# EAGLE design Rev B (Main Board) (EAGLE 9.6.2)
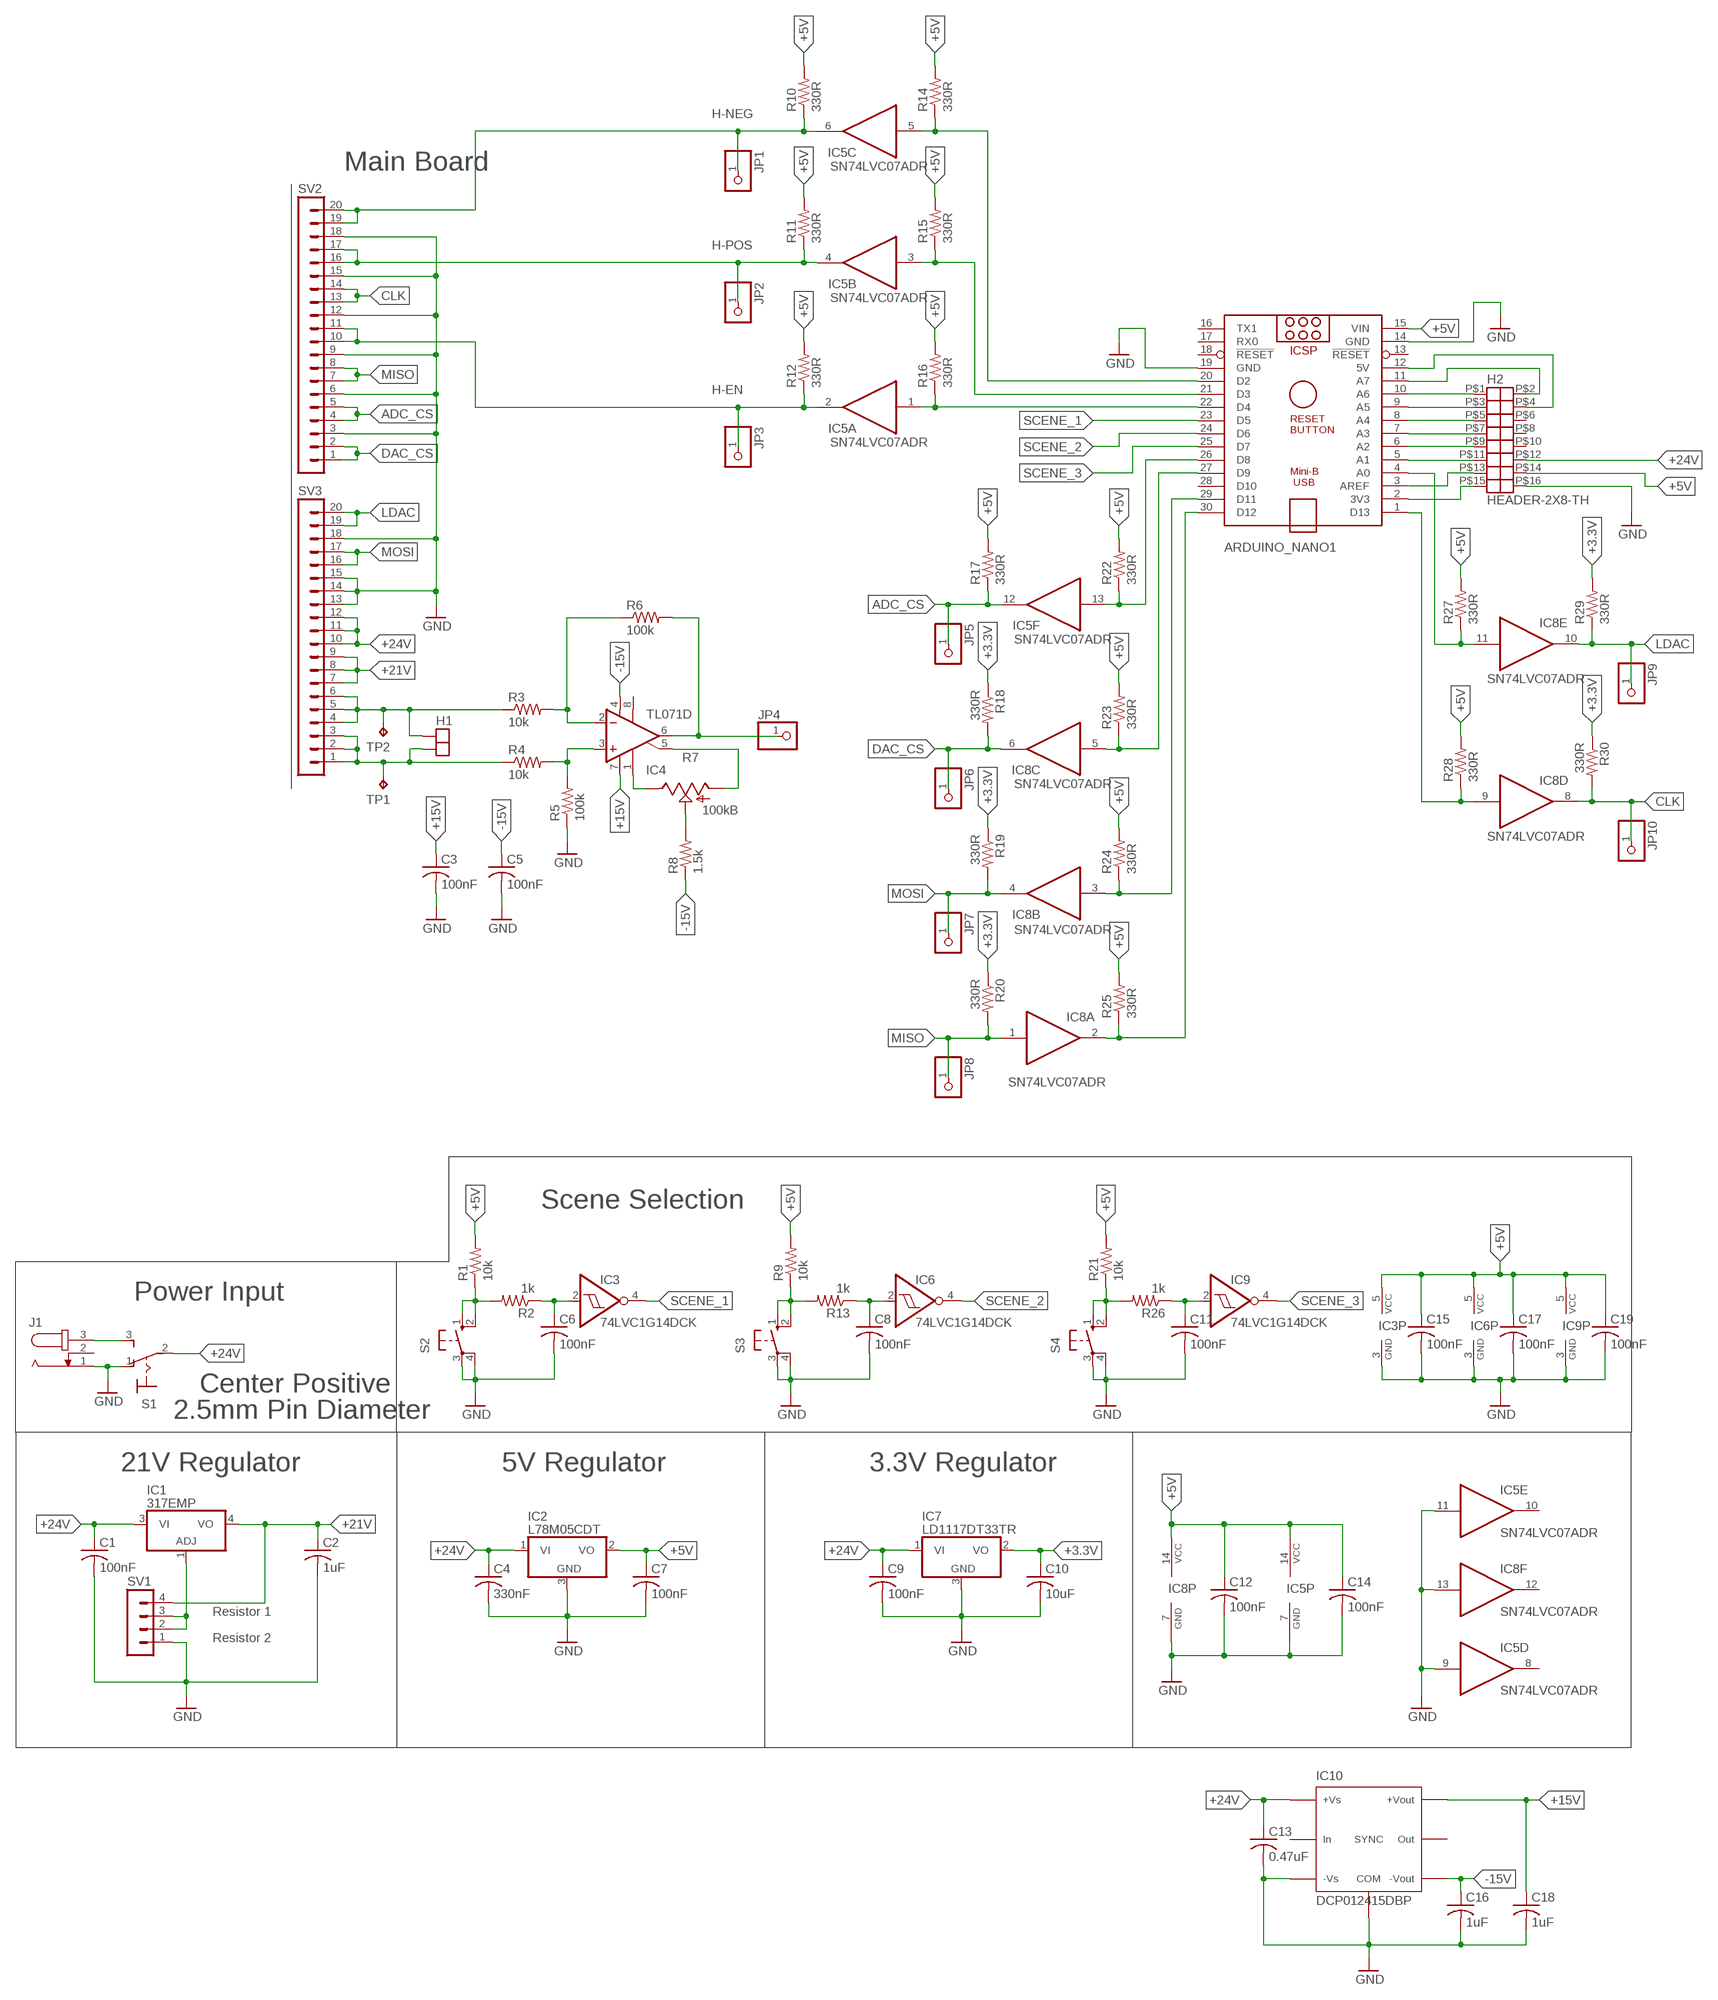
[diagram p0: schematic, sheet 1]

## Parts
ARDUINO_NANO1  ARDUINO_NANO  [ARDUINO_NANO]
C1  100nF  C-USC0805  [C0805]
C2  1uF  C-USC0805  [C0805]
C3  100nF  C-USC0805  [C0805]
C4  330nF  C-USC0805  [C0805]
C5  100nF  C-USC0805  [C0805]
C6  100nF  C-USC0805  [C0805]
C7  100nF  C-USC0805  [C0805]
C8  100nF  C-USC0805  [C0805]
C9  100nF  C-USC0805  [C0805]
C10  10uF  C-USC0805  [C0805]
C11  100nF  C-USC0805  [C0805]
C12  100nF  C-USC0805  [C0805]
C13  0.47uF  C-USC0805  [C0805]
C14  100nF  C-USC0805  [C0805]
C15  100nF  C-USC0805  [C0805]
C16  1uF  C-USC0805  [C0805]
C17  100nF  C-USC0805  [C0805]
C18  1uF  C-USC0805  [C0805]
C19  100nF  C-USC0805  [C0805]
H1  HEADER-1X2  [HEADER-1X2-TH]
H2  HEADER-2X8-TH  [HEADER-2X8-TH]
IC1  317EMP  [SOT223]
IC2  L78M05CDT  7818DT  [TO252]
IC3  74LVC1G14DCK  [SC70-5]
IC4  TL071D  [SO08]
IC5  SN74LVC07ADR  74LS07D  [SO14]
IC6  74LVC1G14DCK  [SC70-5]
IC7  LD1117DT33TR  7818DT  [TO252]
IC8  SN74LVC07ADR  74LS07D  [SO14]
IC9  74LVC1G14DCK  [SC70-5]
IC10  DCP012415DBP  [7-PDIP]
J1  JACK-PLUG1  [SPC4078]
JP1  PINHD-1X1  [1X01]
JP2  PINHD-1X1  [1X01]
JP3  PINHD-1X1  [1X01]
JP4  PINHD-1X1  [1X01]
JP5  PINHD-1X1  [1X01]
JP6  PINHD-1X1  [1X01]
JP7  PINHD-1X1  [1X01]
JP8  PINHD-1X1  [1X01]
JP9  PINHD-1X1  [1X01]
JP10  PINHD-1X1  [1X01]
R1  10k  R-US_R0805  [R0805]
R2  1k  R-US_R0805  [R0805]
R3  10k  R-US_R0805  [R0805]
R4  10k  R-US_R0805  [R0805]
R5  100k  R-US_R0805  [R0805]
R6  100k  R-US_R0805  [R0805]
R7  100kB  TRIM_US-RJ9W  [RJ9W]
R8  1.5k  R-US_R0805  [R0805]
R9  10k  R-US_R0805  [R0805]
R10  330R  R-US_R0805  [R0805]
R11  330R  R-US_R0805  [R0805]
R12  330R  R-US_R0805  [R0805]
R13  1k  R-US_R0805  [R0805]
R14  330R  R-US_R0805  [R0805]
R15  330R  R-US_R0805  [R0805]
R16  330R  R-US_R0805  [R0805]
R17  330R  R-US_R0805  [R0805]
R18  330R  R-US_R0805  [R0805]
R19  330R  R-US_R0805  [R0805]
R20  330R  R-US_R0805  [R0805]
R21  10k  R-US_R0805  [R0805]
R22  330R  R-US_R0805  [R0805]
R23  330R  R-US_R0805  [R0805]
R24  330R  R-US_R0805  [R0805]
R25  330R  R-US_R0805  [R0805]
R26  1k  R-US_R0805  [R0805]
R27  330R  R-US_R0805  [R0805]
R28  330R  R-US_R0805  [R0805]
R29  330R  R-US_R0805  [R0805]
R30  330R  R-US_R0805  [R0805]
S1  320-916  [320-916]
S2  10-XX  [B3F-10XX]
S3  10-XX  [B3F-10XX]
S4  10-XX  [B3F-10XX]
SV1  MA04-1  [MA04-1]
SV2  MA20-1W  [MA20-1W]
SV3  MA20-1W  [MA20-1W]
TP1  TPB2,54  [B2,54]
TP2  TPB2,54  [B2,54]

## Nets
+3.3V: C10.1 IC7.2(VO) R18.1 R19.1 R20.1 R29.2 R30.1
+5V: ARDUINO_NANO1.15(VIN) C7.1 C12.1 C14.1 C15.1 C17.1 C19.1 H2.P$14 IC2.2(VO) IC3.5(VCC) IC5.14(P:VCC) IC6.5(VCC) IC8.14(P:VCC) IC9.5(VCC) R1.2 R9.2 R10.2 R11.2 R12.2 R14.2 R15.2 R16.2 R17.2 R21.2 R22.2 R23.2 R24.2 R25.2 R27.2 R28.2
+15V: C3.1 C18.1 IC4.7(V+) IC10.P$4
+21V: C2.1 IC1.4(VO) SV1.4 SV3.7 SV3.8 SV3.9
+24V: C1.1 C4.1 C9.1 C13.1 H2.P$12 IC1.3(VI) IC2.1(VI) IC7.1(VI) IC10.P$1 S1.2(P) SV3.10 SV3.11 SV3.12
-15V: C5.1 C16.1 IC4.4(V-) IC10.P$5 R8.1
ADC_CS: IC5.12(F:O) JP5.1 R17.1 SV2.4 SV2.5
CLK: IC8.8(D:O) JP10.1 R30.2 SV2.13 SV2.14
DAC_CS: IC8.6(C:O) JP6.1 R18.2 SV2.1 SV2.2
GND: ARDUINO_NANO1.14(GND) ARDUINO_NANO1.19(GND) C1.2 C2.2 C3.2 C4.2 C5.2 C6.2 C7.2 C8.2 C9.2 C10.2 C11.2 C12.2 C13.2 C14.2 C15.2 C16.2 C17.2 C18.2 C19.2 H2.P$16 IC2.3(GND) IC3.3(GND) IC5.7(P:GND) IC5.9(D:I) IC5.11(E:I) IC6.3(GND) IC7.3(GND) IC8.7(P:GND) IC8.13(F:I) IC9.3(GND) IC10.P$2 IC10.P$3 J1.1 R5.1 S1.1(O) S2.3(P) S2.4(P1) S3.3(P) S3.4(P1) S4.3(P) S4.4(P1) SV1.1 SV2.3 SV2.6 SV2.9 SV2.12 SV2.15 SV2.18 SV3.13 SV3.14 SV3.15 SV3.18
LDAC: IC8.10(E:O) JP9.1 R29.1 SV3.19 SV3.20
MISO: IC8.1(A:I) JP8.1 R20.2 SV2.7 SV2.8
MOSI: IC8.4(B:O) JP7.1 R19.2 SV3.16 SV3.17
N$1: IC5.2(A:O) JP3.1 R12.1 SV2.10 SV2.11
N$2: IC4.2(-IN) R3.2 R6.1
N$3: J1.3 S1.3(S)
N$4: ARDUINO_NANO1.2(3V3) H2.P$15
N$5: ARDUINO_NANO1.21(D3) IC5.3(B:I) R15.1
N$6: ARDUINO_NANO1.3(AREF) H2.P$13
N$7: ARDUINO_NANO1.5(A1) H2.P$11
N$8: ARDUINO_NANO1.6(A2) H2.P$9
N$9: ARDUINO_NANO1.22(D4) IC5.1(A:I) R16.1
N$10: ARDUINO_NANO1.7(A3) H2.P$7
N$11: ARDUINO_NANO1.8(A4) H2.P$5
N$12: ARDUINO_NANO1.9(A5) H2.P$3
N$13: ARDUINO_NANO1.10(A6) H2.P$1
N$14: ARDUINO_NANO1.11(A7) H2.P$2
N$15: ARDUINO_NANO1.12(5V) H2.P$4
N$19: ARDUINO_NANO1.27(D9) IC8.5(C:I) R23.1
N$20: ARDUINO_NANO1.1(D13) IC8.9(D:I) R28.1
N$21: ARDUINO_NANO1.29(D11) IC8.3(B:I) R24.1
N$22: H1.P$1 R3.1 SV3.4 SV3.5 SV3.6 TP2.TP
N$23: H1.P$2 R4.1 SV3.1 SV3.2 SV3.3 TP1.TP
N$24: ARDUINO_NANO1.4(A0) IC8.11(E:I) R27.1
N$25: ARDUINO_NANO1.30(D12) IC8.2(A:O) R25.1
N$26: IC5.4(B:O) JP2.1 R11.1 SV2.16 SV2.17
N$27: R1.1 R2.2 S2.1(S) S2.2(S1)
N$28: C6.1 IC3.2(I) R2.1
N$29: R9.1 R13.2 S3.1(S) S3.2(S1)
N$30: C8.1 IC6.2(I) R13.1
N$31: R21.1 R26.2 S4.1(S) S4.2(S1)
N$32: C11.1 IC9.2(I) R26.1
N$33: IC1.1(ADJ) SV1.2 SV1.3
N$34: ARDUINO_NANO1.20(D2) IC5.5(C:I) R14.1
N$35: ARDUINO_NANO1.26(D8) IC5.13(F:I) R22.1
N$36: IC5.6(C:O) JP1.1 R10.1 SV2.19 SV2.20
N$37: IC4.3(+IN) R4.2 R5.2
N$38: IC4.6(OUT) JP4.1 R6.2
N$39: IC4.1(ON1) R7.E
N$40: IC4.5(ON2) R7.A
N$41: R7.S R8.2
SCENE_1: ARDUINO_NANO1.23(D5) IC3.4(O)
SCENE_2: ARDUINO_NANO1.24(D6) IC6.4(O)
SCENE_3: ARDUINO_NANO1.25(D7) IC9.4(O)
Unconnected: ARDUINO_NANO1.13(!RESET) ARDUINO_NANO1.16(TX1) ARDUINO_NANO1.17(RX0) ARDUINO_NANO1.18(!RESET) ARDUINO_NANO1.28(D10) H2.P$6 H2.P$8 H2.P$10 IC4.8(OPT) IC5.8(D:O) IC5.10(E:O) IC8.12(F:O) IC10.P$6 IC10.P$7 J1.2

## Notes on the sheet
- H-NEG
- Main Board
- H-POS
- H-EN
- Scene Selection
- Power Input
- Center Positive
- 2.5mm Pin Diameter
- 21V Regulator | 5V Regulator | 3.3V Regulator
- Resistor 1
- Resistor 2

## Library data of the parts
ARDUINO_NANO1 = ArduinoNanoV30:ARDUINO_NANO: Arduino Nano V3.0 Overview: The Arduino Nano is a small, complete, and breadboard-friendly board based on the ATmega328 (Arduino Nano 3.x) or ATmega168 (Arduino Nano 2.x). It has more or less the same functionality of the Arduino Duemilanove, but in a different package. It lacks only a DC power jack, and works with a Mini-B USB cable instead of a standard one. The Nano was designed and is being produced by Gravitech. Specifications: Microcontroller Atmel ATmega168 or ATmega328 Operating Voltage (logic level) 5 V Input Voltage (recommended) 7-12 V Input Voltage (limits) 6-20 V Digital I/O Pins 14 (of which 6 provide PWM output) Analog Input Pins 8 DC Current per I/O Pin 40 mA Flash Memory 16 KB (ATmega168) or 32 KB (ATmega328) of which 2 KB used by bootloader SRAM 1 KB (ATmega168) or 2 KB (ATmega328) EEPROM 512 bytes (ATmega168) or 1 KB (ATmega328) Clock Speed 16 MHz Dimensions 0.73" x 1.70" Length 45 mm Width 18 mm Weigth 5 g Power: The Arduino Nano can be powered via the Mini-B USB connection, 6-20V unregulated external power supply (pin 30), or 5V regulated external power supply (pin 27). The power source is automatically selected to the highest voltage source. Memory: The ATmega168 has 16 KB of flash memory for storing code (of which 2 KB is used for the bootloader); the ATmega328 has 32 KB, (also with 2 KB used for the bootloader). The ATmega168 has 1 KB of SRAM and 512 bytes of EEPROM (which can be read and written with the EEPROM library); the ATmega328 has 2 KB of SRAM and 1 KB of EEPROM. Input and Output: Each of the 14 digital pins on the Nano can be used as an input or output, using pinMode(), digitalWrite(), and digitalRead() functions. They operate at 5 volts. Each pin can provide or receive a maximum of 40 mA and has an internal pull-up resistor (disconnected by default) of 20-50 kOhms. In addition, some pins have specialized functions. Visit Arduino - ArduinoBoardNano <https://www.arduino.cc/en/Main/ArduinoBoardNano>
C1-C19 = MMIModular Parts:C-US: CAPACITOR, American symbol; SPICEPREFIX: C
H1 = 4ms-main-parts:HEADER-1X2
H2 = 4ms-main-parts:HEADER-2X8: SMT HEADER 2x8 Unshrouded: Cixi Langling LL1010-5C (HI TEMP 2*8PIN) Shrouded: Cixi Langling LL1007-3 (2*8PIN)
IC1 = linear:*317: Positive VOLTAGE REGULATOR
IC2 IC7 = linear:78*: Positive VOLTAGE REGULATOR Source: http://cache.national.com/ds/LM/LM78L05.pdf http://www.fairchildsemi.com/ds/LM/LM7805.pdf
IC3 IC6 IC9 = 74xx-little-de:74*1G14: Single Schmitt-Trigger Inverter Gate
IC4 = linear:TL071: OP AMP
IC5 IC8 = 74xx-us:74*07: Hex BUFFER, open collector high-voltage output
IC10 = MMIModular Parts:DCP012415DBP
J1 = con-jack:JACK-PLUG: DC POWER JACK Power Jack, DC, Right Angle, Through Hole, Rated 5A at 16VDC, PC Terminals Distributor: Farnell (www.Farnell.de) Drawing: 84N1161.pdf / 84N1162.pdf Manufacturer: SPC Technology (www.spctechnology.com) Type: SPC4077 / SPC 4078; OC_FARNELL: unknown; OC_NEWARK: unknown
JP1-JP10 = pinhead:PINHD-1X1: PIN HEADER
R1-R6 R8-R30 = MMIModular Parts:R-US_: RESISTOR, American symbol; SPICEPREFIX: R
R7 = pot:TRIM_US-: POTENTIOMETER
S1 = switch:320-916: TOGGLE SWITCH distributor RS Components
S2-S4 = switch-omron:10-XX: OMRON SWITCH; MPN: B3F-1000; OC_FARNELL: 176432; OC_NEWARK: 36M3542
SV1 = con-lstb:MA04-1: PIN HEADER; OC_FARNELL: unknown; OC_NEWARK: unknown
SV2 SV3 = con-lstb:MA20-1W: PIN HEADER; OC_FARNELL: unknown; OC_NEWARK: unknown
TP1 TP2 = testpad:TP: Test pad

## Board
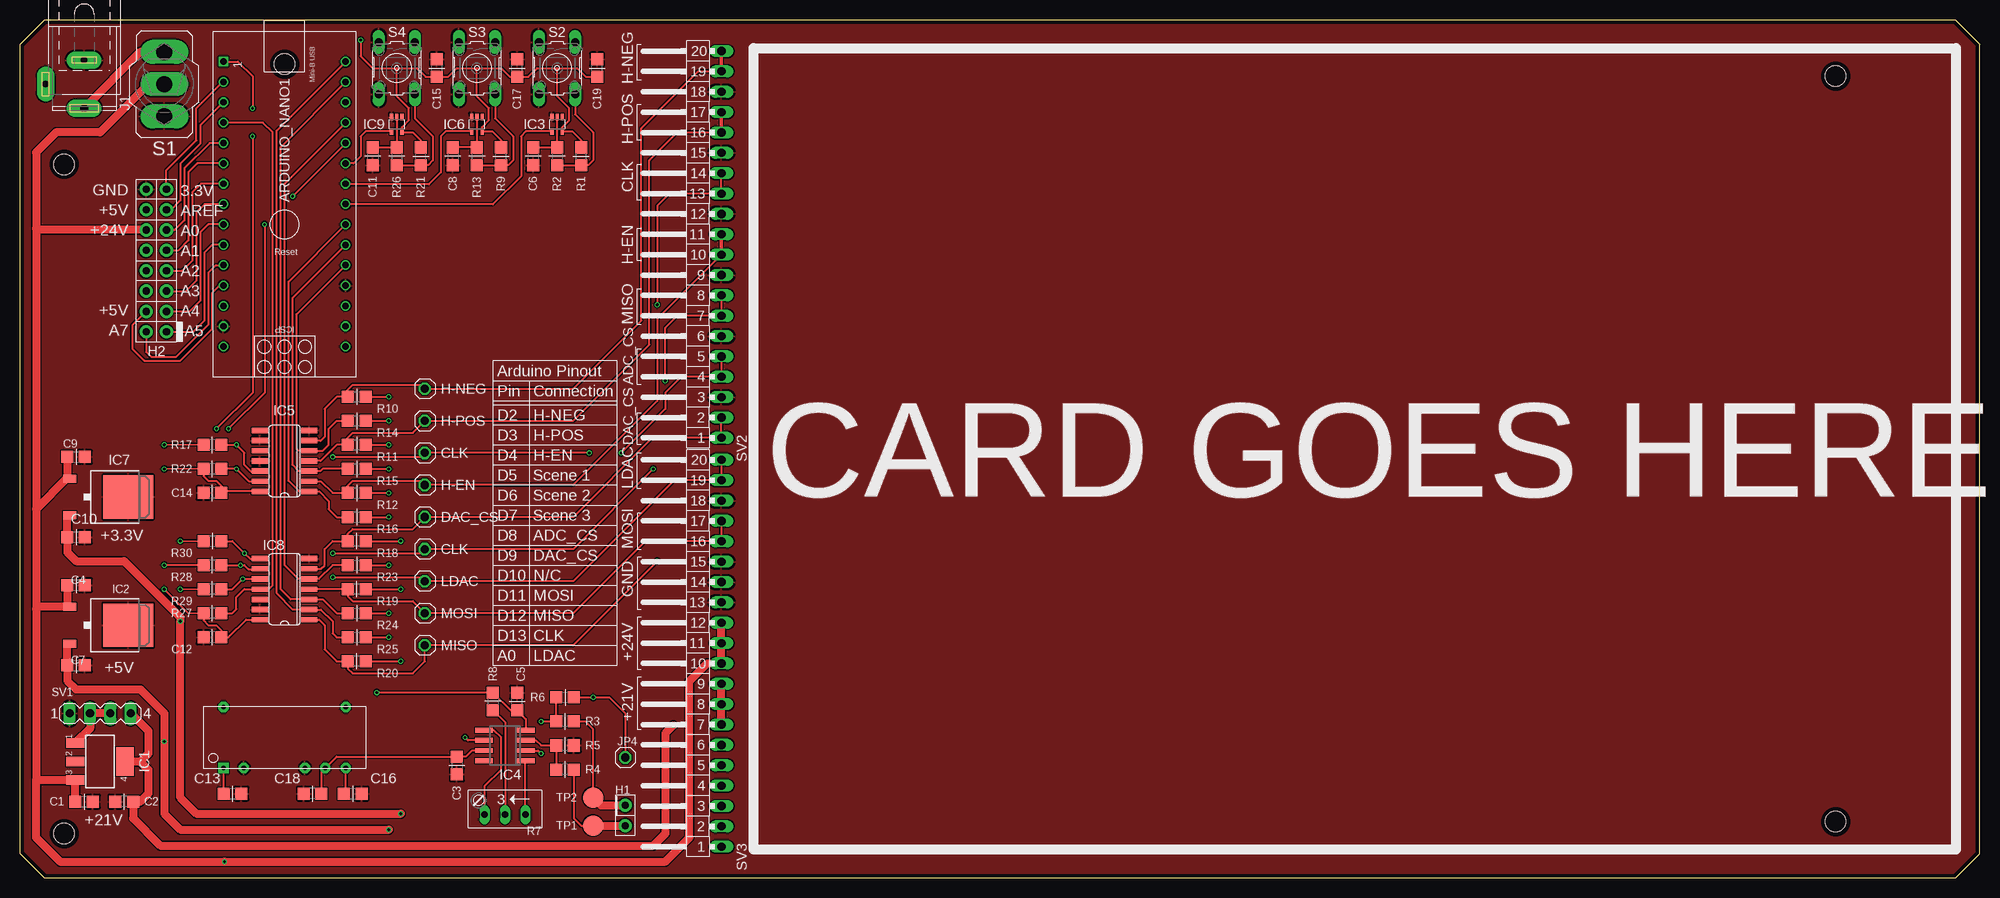
[diagram p1: board, top side]
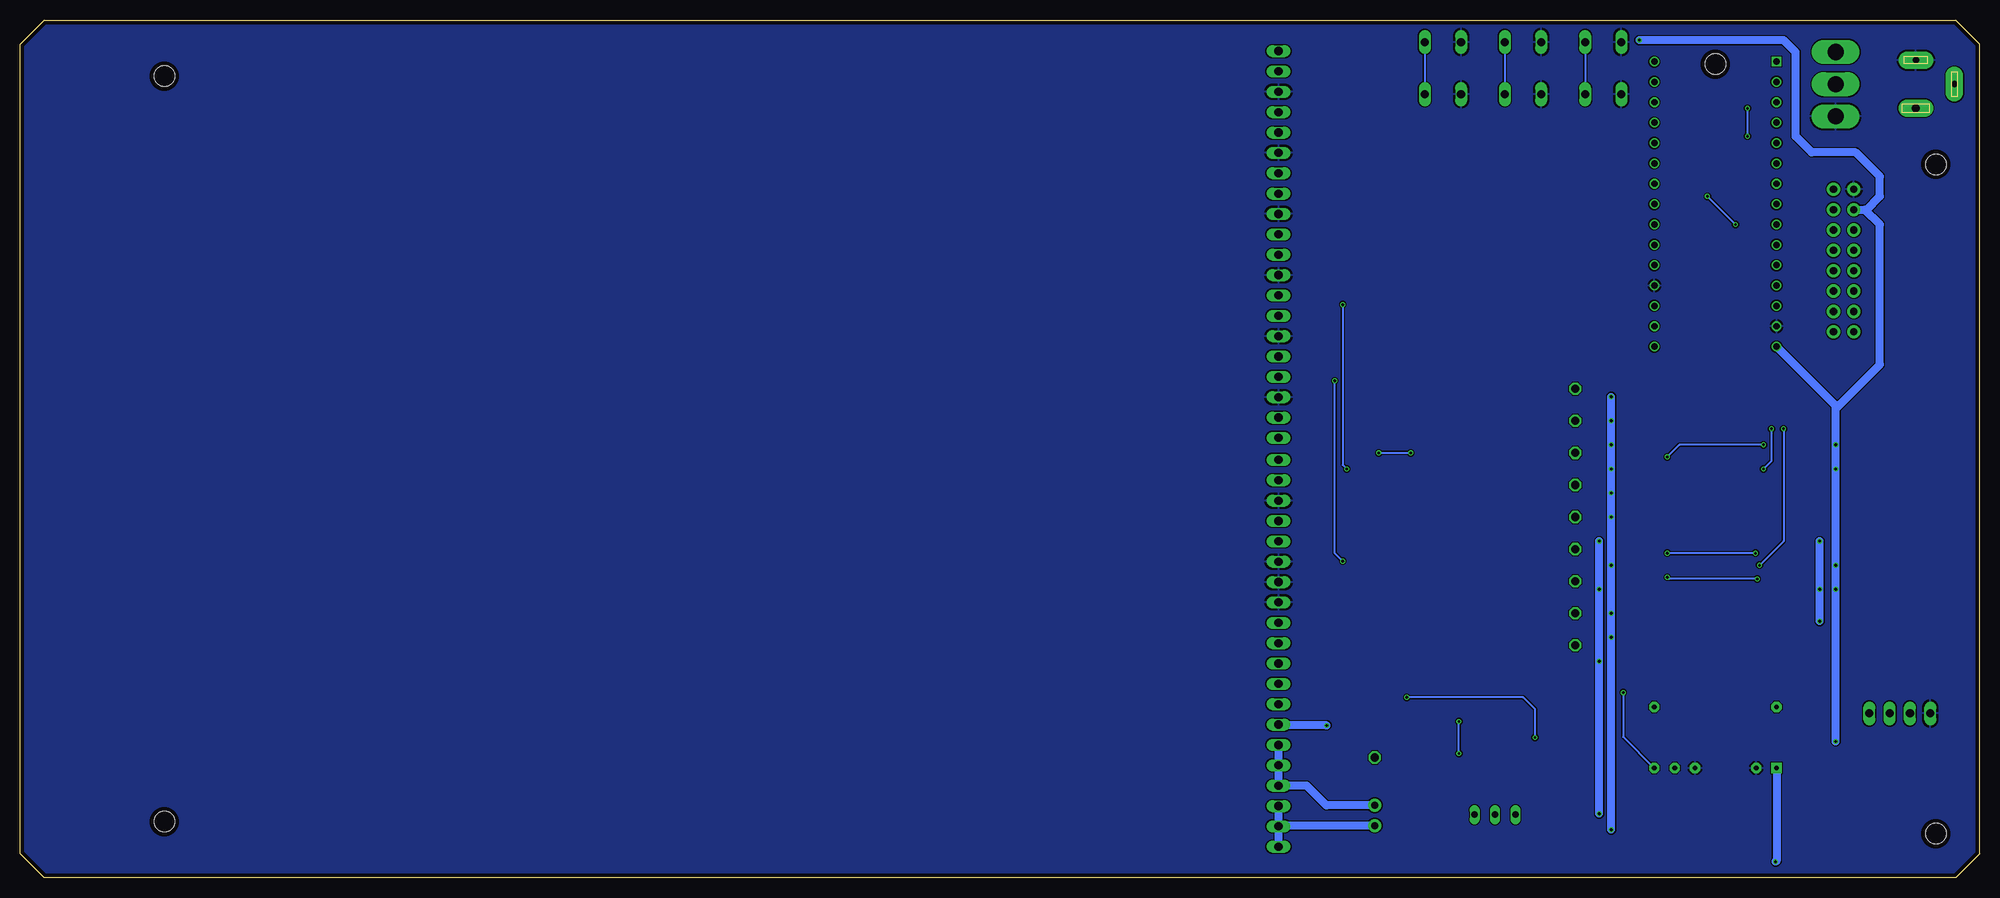
[diagram p2: board, bottom side, seen from below]

Size 244.5 x 107 mm. Coordinates in mm from the lower left corner, seen from the top.
Outline: 3,0 241.5,0 244.5,3 244.5,104 241.5,107 3,107 0,104 0,3 3,0
Copper layers (1*16): Top 0.035559375mm / dielectric 1.6mm / Bottom 0.035559375mm
Design rules "Good Rules (tented vias)": minimum track width 6mil, minimum drill 10mil, track to track 6mil, track to pad 6mil, pad to pad 6mil, via to via 6mil, smd to smd 6mil, copper to edge 20mil, drill to drill 6mil, minimum pad ring 5mil, minimum via ring 5mil, stop-mask expansion 2.5mil, vias tented up to drill 20mil, thermal gap 10mil
Holes 2.6 mm at 226.5,7 226.5,100 33,101.5 5.5,5.5 5.5,89

### Footprints (pad centres in the part's own frame; a part is rotated, then mirrored left to right if it is on the bottom)
ARDUINO_NANO = drill 0.8 square: 1 -20.32,-7.62 | drill 0.8: 2 -17.78,-7.62; 3 -15.24,-7.62; 4 -12.7,-7.62; 5 -10.16,-7.62; 6 -7.62,-7.62; 7 -5.08,-7.62; 8 -2.54,-7.62; 9 0,-7.62; 10 2.54,-7.62; 11 5.08,-7.62; 12 7.62,-7.62; 13 10.16,-7.62; 14 12.7,-7.62; 15 15.24,-7.62; 16 15.24,7.62; 17 12.7,7.62; 18 10.16,7.62; 19 7.62,7.62; 20 5.08,7.62; 21 2.54,7.62; 22 0,7.62; 23 -2.54,7.62; 24 -5.08,7.62; 25 -7.62,7.62; 26 -10.16,7.62; 27 -12.7,7.62; 28 -15.24,7.62; 29 -17.78,7.62; 30 -20.32,7.62
C0805 = smd 1.5 x 1.5: 1 -1.1,0; 2 1.1,0
HEADER-1X2-TH = drill 0.9 pad 1.651: P$1 0,2.54; P$2 0,0
HEADER-2X8-TH = drill 0.9 pad 1.651: P$1 -1.27,8.89; P$2 1.27,8.89; P$3 -1.27,6.35; P$4 1.27,6.35; P$5 -1.27,3.81; P$6 1.27,3.81; P$7 -1.27,1.27; P$8 1.27,1.27; P$9 -1.27,-1.27; P$10 1.27,-1.27; P$11 -1.27,-3.81; P$12 1.27,-3.81; P$13 -1.27,-6.35; P$14 1.27,-6.35; P$15 -1.27,-8.89; P$16 1.27,-8.89
SOT223 = smd 1.219 x 2.235: 1 -2.311,-3.099; 2 0,-3.099; 3 2.311,-3.099 | smd 3.6 x 2.2: 4 0,3.099
TO252 = smd 1 x 1.6: 1 -2.28,-4.8; 2 2.28,-4.8 | smd 5.4 x 6.2: 3 0,2.5
SC70-5 = smd 0.4 x 0.85: 1 -0.65,-0.9; 2 0,-0.9; 3 0.65,-0.9; 4 0.65,0.9; 5 -0.65,0.9
SO08 = smd 0.6 x 2.2: 1 -1.905,-2.6; 2 -0.635,-2.6; 3 0.635,-2.6; 4 1.905,-2.6; 5 1.905,2.6; 6 0.635,2.6; 7 -0.635,2.6; 8 -1.905,2.6
SO14 = smd 0.66 x 2.032: 1 -3.81,-3.073; 2 -2.54,-3.073; 3 -1.27,-3.073; 4 0,-3.073; 5 1.27,-3.073; 6 2.54,-3.073; 7 3.81,-3.073; 8 3.81,3.073; 9 2.54,3.073; 10 1.27,3.073; 11 0,3.073; 12 -1.27,3.073; 13 -2.54,3.073; 14 -3.81,3.073
7-PDIP = drill 0.6 pad 1.27 square: P$1 -3.81,7.62 | drill 0.6 pad 1.27 octagon: P$2 -3.81,5.08; P$3 -3.81,-2.54; P$4 -3.81,-5.08; P$5 -3.81,-7.62; P$6 3.81,7.62; P$7 3.81,-7.62
SPC4078 = drill 0.8 pad 2.184 long: 1 -3,0; 2 0,-4.8 | drill 1 pad 2.184 long: 3 3,0
1X01 = drill 1.016 octagon: 1 0,0
R0805 = smd 1.5 x 1.5: 1 -1.1,0; 2 1.1,0
RJ9W = drill 0.813 long: A 2.54,0.635; E -2.54,0.635; S 0,0.635
320-916 = drill 2.007 long: 1 0,4.013; 2 0,0; 3 0,-4.013
B3F-10XX = drill 1.016 long: 1 -3.251,2.261; 2 3.251,2.261; 3 -3.251,-2.261; 4 3.251,-2.261
MA04-1 = drill 1.016 long: 1 -3.81,0; 2 -1.27,0; 3 1.27,0; 4 3.81,0
MA20-1W = drill 1.016 long: 1 -24.13,0; 2 -21.59,0; 3 -19.05,0; 4 -16.51,0; 5 -13.97,0; 6 -11.43,0; 7 -8.89,0; 8 -6.35,0; 9 -3.81,0; 10 -1.27,0; 11 1.27,0; 12 3.81,0; 13 6.35,0; 14 8.89,0; 15 11.43,0; 16 13.97,0; 17 16.51,0; 18 19.05,0; 19 21.59,0; 20 24.13,0
B2,54 = smd 2.54 x 2.54: TP 0,0

### Placement (x,y rotation side)
ARDUINO_NANO1  33,81.5 270 top
C1  8,9.5 0 top
C2  13,9.5 180 top
C3  54.5,14 270 top
C4  7,36.5 0 top
C5  62,22 90 top
C6  64,90 270 top
C7  7,26.5 0 top
C8  54,90 270 top
C9  7,52.5 0 top
C10  7,42.5 0 top
C11  44,90 270 top
C12  24,30 180 top
C13  26.5,10.5 0 top
C14  24,48 180 top
C15  52,101 90 top
C16  41.5,10.5 0 top
C17  62,101 90 top
C18  36.5,10.5 180 top
C19  72,101 90 top
H1  75.5,6.5 0 top
H2  17,77 180 top
IC1  10,14.5 270 top
IC2  11,31.5 270 top
IC3  67,94 180 top
IC4  60.5,16.5 90 top
IC5  33,52 90 top
IC6  57,94 180 top
IC7  11,47.5 270 top
IC8  33,36 90 top
IC9  47,94 180 top
IC10  33,17.5 90 top
J1  8,99 270 top
JP1  50.5,61 0 top
JP2  50.5,57 0 top
JP3  50.5,49 0 top
JP4  75.5,15 0 top
JP5  50.5,53 0 top
JP6  50.5,45 0 top
JP7  50.5,33 0 top
JP8  50.5,29 0 top
JP9  50.5,37 0 top
JP10  50.5,41 0 top
R1  70,90 90 top
R2  67,90 270 top
R3  68,19.5 180 top
R4  68,13.5 180 top
R5  68,16.5 180 top
R6  68,22.5 0 top
R7  60.5,8.5 180 top
R8  59,22 270 top
R9  60,90 90 top
R10  42,60 0 top
R11  42,54 0 top
R12  42,48 0 top
R13  57,90 270 top
R14  42,57 0 top
R15  42,51 0 top
R16  42,45 0 top
R17  24,54 180 top
R18  42,42 180 top
R19  42,36 180 top
R20  42,27 180 top
R21  50,90 90 top
R22  24,51 180 top
R23  42,39 0 top
R24  42,33 0 top
R25  42,30 0 top
R26  47,90 270 top
R27  24,33 180 top
R28  24,39 180 top
R29  24,36 180 top
R30  24,42 0 top
S1  18,99 180 top
S2  67,101 270 top
S3  57,101 270 top
S4  47,101 270 top
SV1  10,20.5 0 top
SV2  87.5,79 90 top
SV3  87.5,28 90 top
TP1  71.5,6.5 0 top
TP2  71.5,10 0 top

### Tracks (layer width: path | path; a pad name or v marks a point on that pad's centre or on a via)
+3.3V  (via drill 0.35)
  Top 0.203: R30.1 v20,42 | R29.2 v20,36
  Top 0.254: R18.1 v47.5,42 | R19.1 v47.5,36 | R20.1 v47.5,27
  Top 1.016: IC7.2 5.9,44.92 C10.1 5.9,40.6 7,39.5 13,39.5 20,32.5 v20,32 20,10 22,8 v47.5,8
  Bottom 1.016: v47.5,8 v47.5,27 v47.5,36 v47.5,42 | v20,32 v20,36 v20,42
+5V  (via drill 0.35)
  Top 0.203: R27.2 21,33 v18,36 | R22.2 v18,51 | R17.2 v18,54
  Top 0.254: R21.2 50,92 49,93 47.75,93 IC9.5 47.65,93.65 48.5,94.5 48.5,96 47,97.5 47,101 | R9.2 60,92 58.9,93.1 IC6.5 57.65,93.65 58.5,94.5 58.5,96 57,97.5 57,101 | R1.2 70,92 68.9,93.1 IC3.5 67.65,93.65 68.5,94.5 68.5,96 67,97.5 67,101 | IC5.14 25.29,48.19 C14.1 25.1,48.9 24.5,49.5 23.5,49.5 22.9,50.1 R22.2 | IC8.14 28.19,32.19 26,30 C12.1 25.1,30.9 24.5,31.5 23.5,31.5 22.9,32.1 R27.2 | R10.2 v46,60 | R14.2 v46,57 | R11.2 v46,54 | R15.2 v46,51 | R12.2 v46,48 | R16.2 v46,45 | R23.2 v46,39 | R24.2 v46,33 | R25.2 v46,30 | v42.5,104.5 42.5,102.5 44,101 47,101 | 47,101 49.5,101 50.6,99.9 C15.1 53.4,99.9 54.5,101 57,101 | 57,101 60,101 61.1,99.9 C17.1 63.4,99.9 64.5,101 67,101 | 67,101 69.5,101 70.6,99.9 C19.1 | R28.2 v18,39
  Top 1.016: IC2.2 5.9,28.92 C7.1 5.9,24.6 7,23.5 15,23.5 18,20.5 v18,17 18,8 20,6 v46,6
  Bottom 1.016: v46,6 v46,30 v46,33 v46,39 v46,45 v46,48 v46,51 v46,54 v46,57 v46,60 | v18,17 v18,36 v18,39 v18,51 v18,54 18,58.5 | 18,58.5 18,58.88 ARDUINO_NANO1.15 | 18,58.5 12.5,64 12.5,81.5 14.35,83.35 | H2.P$14 14.35,83.35 | 14.35,83.35 14.15,83.35 12.5,85 12.5,87.5 15.5,90.5 21,90.5 23,92.5 23,103 24.5,104.5 v42.5,104.5
+15V
  Top 0.254: IC4.7 56.37,15.87 55.6,15.1 C3.1 39.49,15.1 IC10.P$4 37.6,13.21 C18.1
+21V  (via drill 0.35)
  Top 1.016: SV3.7 SV3.8 SV3.9 | SV1.4 16,18.31 16,15.5 15,14.5 | 15,14.5 IC1.4 | 15,14.5 16,13.5 16,10.5 15,9.5 C2.1 14.1,7.4 17.5,4 79,4 80.5,5.5 80.5,18 v81.5,19
  Bottom 1.016: v81.5,19 87.39,19 SV3.7
+24V  (via drill 0.35)
  Top 0.254: C13.1 25.4,13.67 IC10.P$1
  Top 1.016: SV3.12 SV3.11 SV3.10 85.73,26.73 83.5,24.5 83.5,5 80.5,2 v25.5,2 5,2 2,5 2,12.19 | S1.2 16,99 10,93 4.5,93 2,90.5 2,81 | 2,81 2,46 | 2,46 2,33.5 | 2,33.5 2,12.19 | 2,12.19 IC1.3 C1.1 | 2,33.5 2.28,33.78 IC2.1 5.9,34.08 C4.1 | 2,46 5.78,49.78 IC7.1 5.9,50.08 C9.1 | H2.P$12 2.19,80.81 2,81
  Bottom 1.016: IC10.P$1 25.38,2.12 v25.5,2
-15V  (via drill 0.35)
  Top 0.254: IC4.4 63.1,19.8 C5.1 61.2,20.9 R8.1 v44.5,23.1 | C16.1 40.62,10.72 IC10.P$5
  Bottom 0.254: v44.5,23.1 44.5,17.57 IC10.P$5
ADC_CS  (via drill 0.35)
  Top 0.254: SV2.5 SV2.4 82.49,62.49 80.5,60.5 80.5,58.5 v75,53 | R17.1 v27,54 28,53 28,51.5 28.77,50.73 IC5.12 | v39,52.5 50,52.5 JP5.1 v71,53
  Bottom 0.254: v27,54 37.5,54 v39,52.5 | v75,53 v71,53
CLK  (via drill 0.35)
  Top 0.254: SV2.14 SV2.13 81,85.35 79.5,83.85 v79.5,71.5 | R30.2 26.5,42 v28,40.5 28.69,39.81 IC8.8 | v39,40.5 50,40.5 JP10.1 69,41 v79,51
  Bottom 0.254: v28,40.5 v39,40.5 | v79.5,71.5 79.5,51.5 v79,51
DAC_CS
  Top 0.254: SV2.2 SV2.1 78.87,54.87 69,45 JP6.1 49,43.5 41.5,43.5 40.9,42.9 R18.2 39,42 38,41 38,39 37.54,38.54 IC8.6
GND
  pour Top: -3,109.5 -3,-3.5 248.5,-3.5 248.5,110 -3,110
  pour Bottom: -2,109 -2,-7 247,-7 247,109
LDAC  (via drill 0.35)
  Top 0.254: SV3.20 SV3.19 81.59,49.59 69,37 JP9.1 50,37.5 v39,37.5 | R29.1 26.5,36 v27.77,37.27 IC8.10
  Bottom 0.254: v27.77,37.27 38.77,37.27 v39,37.5
MISO  (via drill 0.35)
  Top 0.254: SV2.8 SV2.7 82,70.11 80.5,68.61 v80.5,62 | IC8.1 37.31,32.19 38,31.5 38,28.5 39.5,27 R20.2 40.9,26.1 41.5,25.5 49,25.5 50.5,27 JP8.1 69,29 v79.5,39.5
  Bottom 0.254: v79.5,39.5 80.5,40.5 v80.5,62
MOSI
  Top 0.254: SV3.17 SV3.16 77.97,41.97 69,33 JP7.1 49,34.5 41.5,34.5 40.9,35.1 R19.2 IC8.4
N$1
  Top 0.254: IC5.2 37.54,49.46 39,48 R12.1 40.9,48.9 41.5,49.5 50,49.5 JP3.1 69,49 79.5,59.5 79.5,69.73 SV2.10
  Top 0.406: SV2.10 SV2.11
N$2  (via drill 0.35)
  Top 0.254: IC4.2 64.64,15.87 v65,15.5 | v65,19.5 R3.2 R6.1
  Bottom 0.254: v65,15.5 v65,19.5
N$3
  Top 1.016: S1.3 15.01,103.01 J1.3
N$4
  Top 0.254: H2.P$15 18.27,88.27 22,92 22,96 25.28,99.28 ARDUINO_NANO1.2
N$5
  Top 0.254: R15.1 37.75,51 37.48,50.73 IC5.3 34.77,50.73 34,51.5 34,72.34 ARDUINO_NANO1.21
N$6
  Top 0.254: ARDUINO_NANO1.3 22.5,93.86 22.5,91.58 20,89.08 20,84.5 18.85,83.35 H2.P$13
N$7
  Top 0.254: ARDUINO_NANO1.5 23.66,91.66 20.5,88.5 20.5,82 19.31,80.81 H2.P$11
N$8
  Top 0.254: ARDUINO_NANO1.6 22.12,89.12 21,88 21,79.5 19.77,78.27 H2.P$9
N$9
  Top 0.254: R16.1 39.5,45 38.5,46 38.5,47 37.31,48.19 IC5.1 34.81,48.19 33.5,49.5 33.5,74.38 ARDUINO_NANO1.22
N$10
  Top 0.254: H2.P$7 20.23,75.73 21.5,77 21.5,85.5 22.58,86.58 ARDUINO_NANO1.7
N$11
  Top 0.254: ARDUINO_NANO1.8 23.04,84.04 22,83 22,74.5 20.69,73.19 H2.P$5
N$12
  Top 0.254: ARDUINO_NANO1.9 23.5,81.5 22.5,80.5 22.5,72 21.15,70.65 H2.P$3
N$13
  Top 0.254: ARDUINO_NANO1.10 23.96,78.96 23,78 23,69.5 21.61,68.11 H2.P$1
N$14
  Top 0.254: H2.P$2 15.73,65.61 16.34,65 19.5,65 23.5,69 23.5,75.5 24.42,76.42 ARDUINO_NANO1.11
N$15
  Top 0.254: H2.P$4 14,68.92 14,66 15.5,64.5 20,64.5 24,68.5 24,73 24.88,73.88 ARDUINO_NANO1.12
N$19
  Top 0.254: R23.1 39,39 37.27,37.27 IC8.5 34.73,37.27 33,39 33,86.58 ARDUINO_NANO1.27
N$20  (via drill 0.35)
  Top 0.254: R28.1 v27.5,39 28,39 28.5,38.5 29.89,38.5 IC8.9 | ARDUINO_NANO1.1 27.18,101.82 29,100 v29,96 | v29,92.5 29,60.5 v24.5,56
  Bottom 0.254: v29,96 v29,92.5 | v24.5,56 24.5,42 v27.5,39
N$21
  Top 0.254: R24.1 39.5,33 37.77,34.73 IC8.3 33.77,34.73 32.5,36 32.5,55 32.5,91.16 ARDUINO_NANO1.29
N$22
  Top 0.254: R3.1 70.5,19.5 71.5,18.5 TP2.TP
  Top 1.016: TP2.TP 71.54,10 72.5,9.04 H1.P$1
  Bottom 1.016: SV3.6 SV3.5 SV3.4 83.99,11.49 81.54,9.04 H1.P$1
N$23
  Top 0.254: R4.1 69.1,7.4 70,6.5 TP1.TP
  Top 1.016: TP1.TP H1.P$2
  Bottom 1.016: SV3.1 SV3.2 | SV3.2 SV3.3 | H1.P$2 87.41,6.5 SV3.2
N$24
  Top 0.254: R27.1 26.5,33 27,33.5 27,35 28,36 IC8.11 31,36 31.5,36.5 31.5,93 30.3,94.2 ARDUINO_NANO1.4
N$25
  Top 0.254: R25.1 39.5,30 39,30.5 39,32 37.54,33.46 IC8.2 34.04,33.46 32,35.5 32,93.2 ARDUINO_NANO1.30
N$26
  Top 0.254: IC5.4 37.5,52 39.5,54 R11.1 40.9,54.9 41.5,55.5 49,55.5 JP2.1 69,57 78.5,66.5 78.5,89.5 82,93 87.47,93 SV2.16
  Top 0.406: SV2.16 SV2.17
N$27
  Top 0.254: R2.2 R1.1 70.9,88.9 71.5,89.5 71.5,93 69.26,95.24 S2.2
  Bottom 0.254: S2.1 S2.2
N$28
  Top 0.254: IC3.2 R2.1 C6.1
N$29
  Top 0.254: R13.2 R9.1 60.9,88.9 61.5,89.5 61.5,92.5 59.26,94.74 S3.2
  Bottom 0.254: S3.1 S3.2
N$30
  Top 0.254: IC6.2 R13.1 C8.1
N$31
  Top 0.254: R26.2 R21.1 50.9,88.9 51.5,89.5 51.5,92.5 49.26,94.74 S4.2
  Bottom 0.254: S4.1 S4.2
N$32
  Top 0.254: IC9.2 R26.1 C11.1
N$33
  Top 1.016: IC1.1 8.73,18.64 SV1.2 SV1.3
N$34
  Top 0.254: R14.1 39.5,57 38.5,56 38.5,54 37.77,53.27 IC5.5 34.73,53.27 34.5,53.5 34.5,70.3 ARDUINO_NANO1.20
N$35  (via drill 0.35)
  Top 0.254: IC5.13 28.54,49.46 v27,51 R22.1 | ARDUINO_NANO1.26 34,85.04 v34,85 | v30.5,81.5 30.5,60.5 v26,56
  Bottom 0.254: v34,85 v30.5,81.5 | v27,51 26,52 v26,56
N$36
  Top 0.254: IC5.6 36.11,54.5 37.5,54.5 38,55 38,58.5 39.5,60 R10.1 40.9,60.9 41.5,61.5 50,61.5 JP1.1 69,61 77.5,69.5 77.5,93.5 84.59,100.59 SV2.19
  Top 0.406: SV2.19 SV2.20
N$37
  Top 0.254: R4.2 R5.2 65,16.5 64.36,17.14 IC4.3
N$38  (via drill 0.35)
  Top 0.254: R6.2 v71.5,22.5 73.5,22.5 75.5,20.5 JP4.1 | IC4.6 55.87,17.14 v55.5,17.5
  Bottom 0.254: v55.5,17.5 55.5,21 57,22.5 v71.5,22.5
N$39
  Top 0.254: R7.E 63.04,14.54 IC4.1
N$40
  Top 0.254: R7.A 57.96,11.46 60,13.5 60,17.5 59.09,18.41 IC4.5
N$41
  Top 0.254: R8.2 60.5,19.4 R7.S
SCENE_1
  Top 0.254: IC3.4 63.1,93.1 62.5,92.5 62.5,87.5 59,84 40.66,84 ARDUINO_NANO1.23
SCENE_2
  Top 0.254: IC6.4 53.1,93.1 52.5,92.5 52.5,88 51,86.5 40.7,86.5 ARDUINO_NANO1.24
SCENE_3
  Top 0.254: IC9.4 43.1,93.1 42.5,92.5 42.5,90 41.62,89.12 ARDUINO_NANO1.25

### Text on the board
tPlace: H-NEG | H-POS | GND | CLK | 3.3V | +5V | +24V | AREF | A0 | A1 | H-EN | A2 | +5V | A3 | A4 | A7 | MISO | A5 | Arduino Pinout | ADC_CS | H-NEG | Pin | Connection | H-POS | D2 | H-NEG | D3 | H-POS | DAC_CS | CARD GOES HERE | CLK | D4 | H-EN | D5 | Scene 1 | H-EN | LDAC | D6 | Scene 2 | DAC_CS | D7 | Scene 3 | +3.3V | D8 | ADC_CS | CLK | MOSI | D9 | DAC_CS | LDAC | D10 | N/C | GND | D11 | MOSI | MOSI | D12 | MISO | D13 | CLK | MISO | A0 | LDAC | +24V | +5V | +21V | +21V